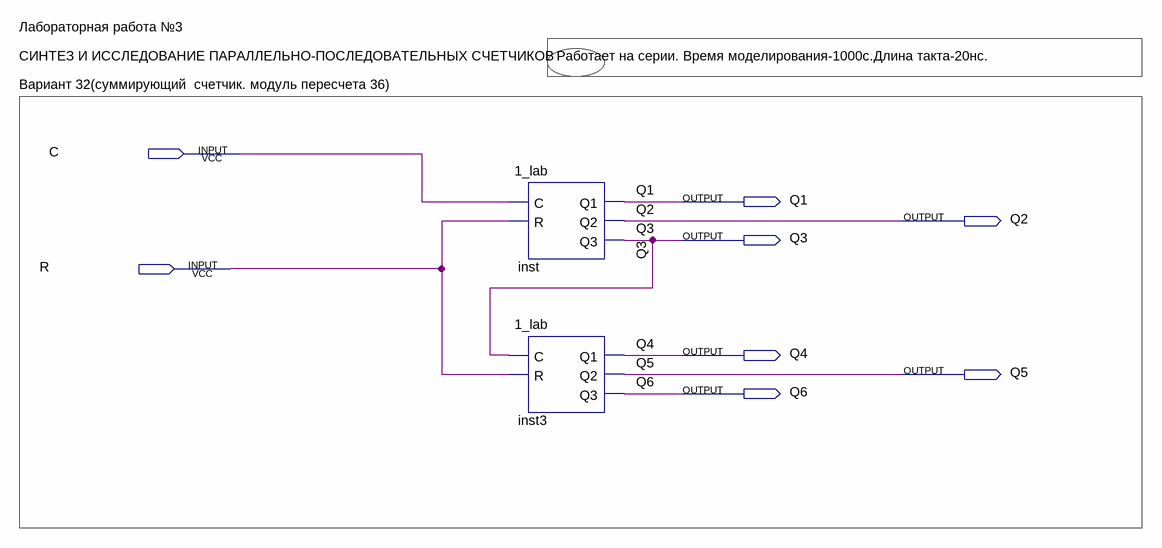
[diagram p0: schematic sheet]
// Quartus schematic 1_labb.bdf as structural Verilog: 2 symbols, 8 pins
module \1_labb  (
  input  C,
  input  R,
  output Q1,
  output Q2,
  output Q3,
  output Q4,
  output Q5,
  output Q6
);

  \1_lab  inst (.C(C), .R(R), .Q1(Q1), .Q2(Q2), .Q3(Q3));
  \1_lab  inst3 (.C(Q3), .R(R), .Q1(Q4), .Q2(Q5), .Q3(Q6));

  // Notes on the sheet:
  //   Лабораторная работа №3
  //   СИНТЕЗ И ИССЛЕДОВАНИЕ ПАРАЛЛЕЛЬНО-ПОСЛЕДОВАТЕЛЬНЫХ СЧЕТЧИКОВ
  //   Работает на серии. Время моделирования-1000с.Длина такта-20нс.
  //   Вариант 32(суммирующий  счетчик. модуль пересчета 36)
endmodule
